# EAGLE schematic Animated LED Shifter using CD4017 (EAGLE 6.6.0)
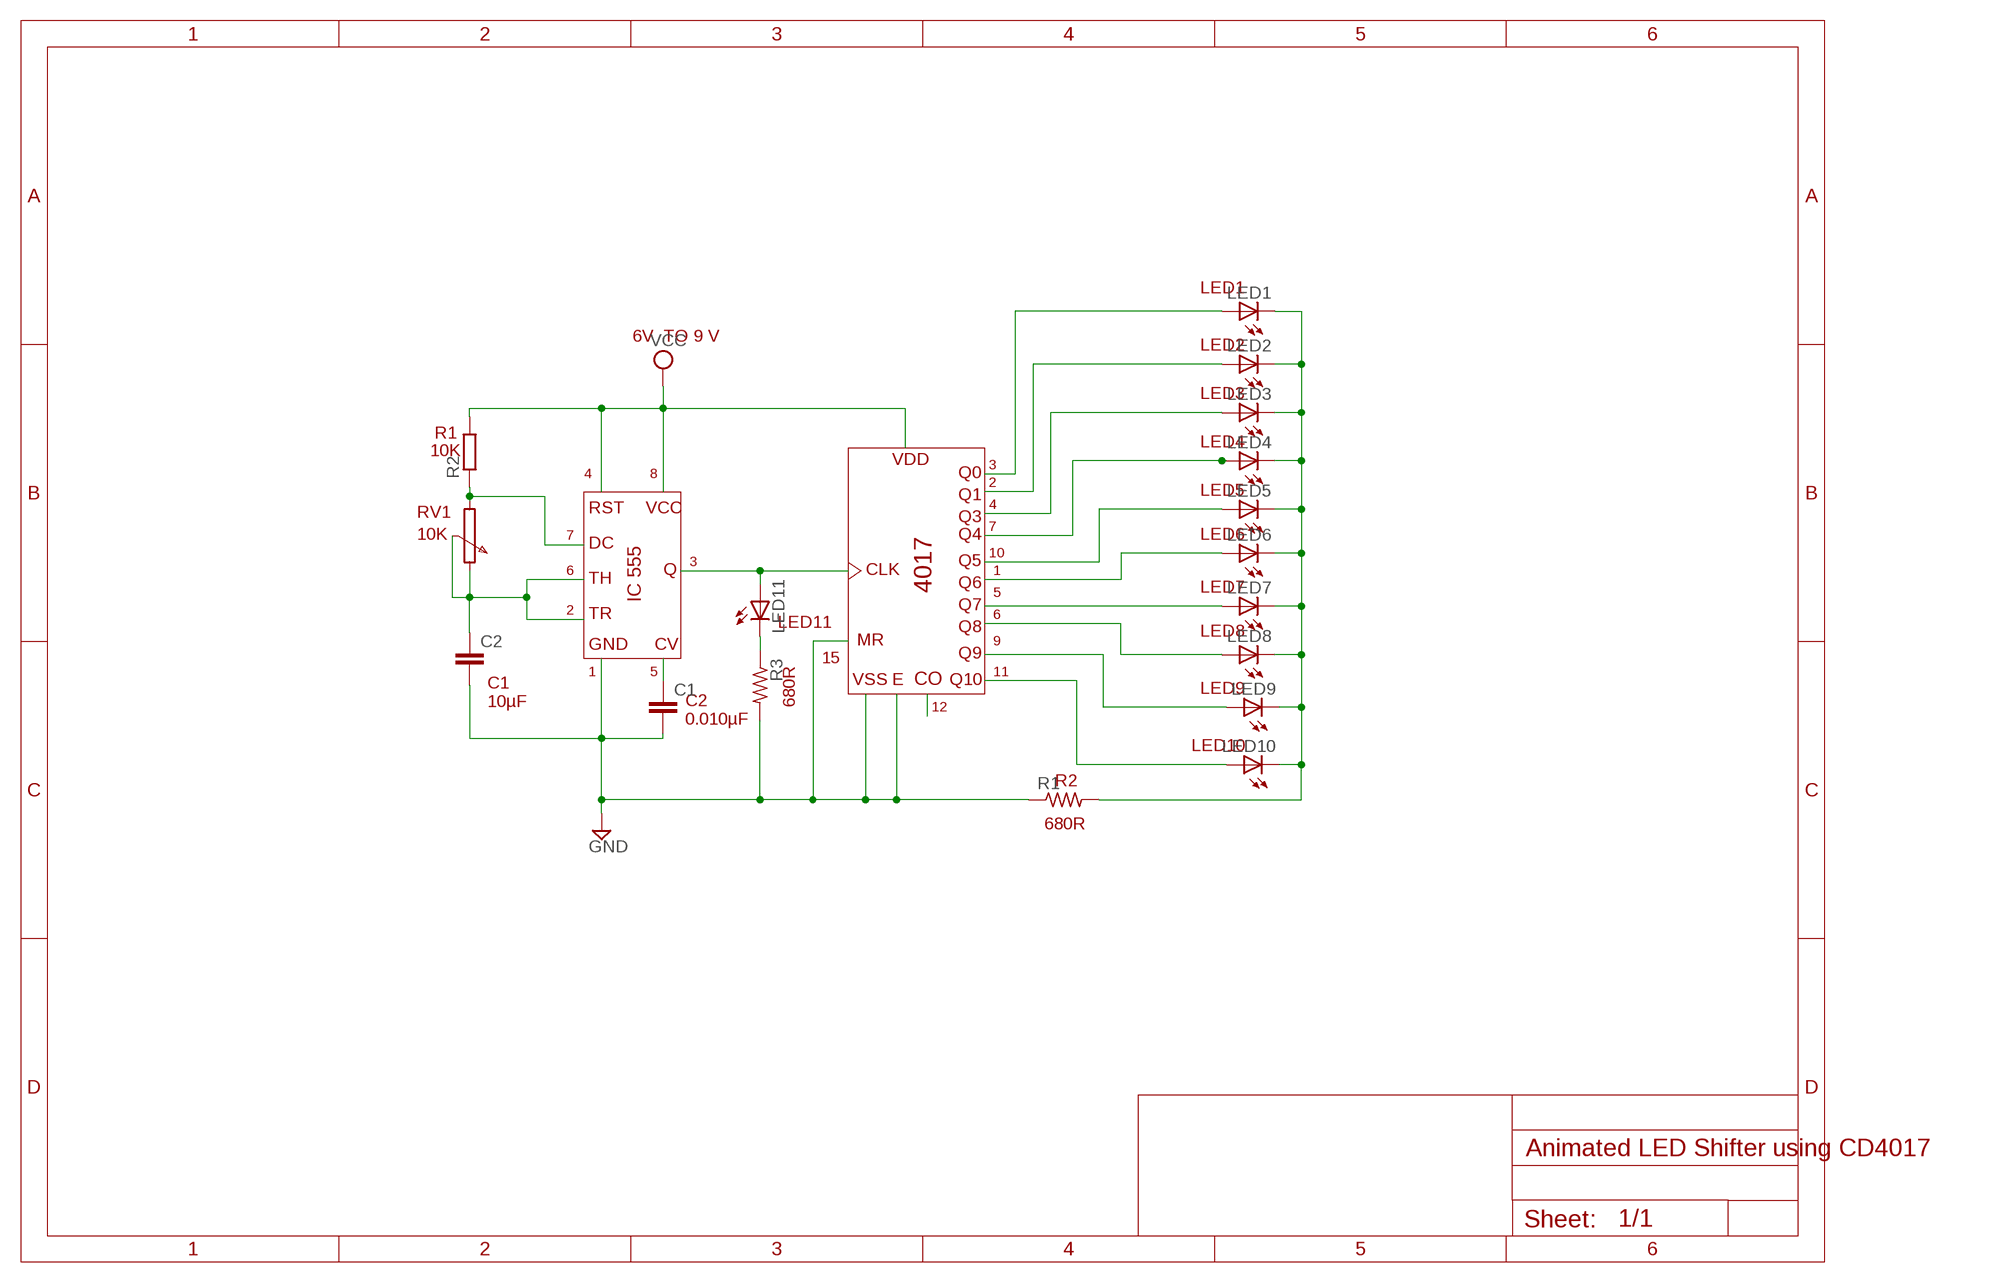
[diagram p0: schematic, sheet 1]

## Parts
C1  C5/3.5  [C5B3.5]
C2  C5/3.5  [C5B3.5]
LED1  LEDMICRO-SIDELED  [MICRO-SIDELED]
LED2  LEDMICRO-SIDELED  [MICRO-SIDELED]
LED3  LEDMICRO-SIDELED  [MICRO-SIDELED]
LED4  LEDMICRO-SIDELED  [MICRO-SIDELED]
LED5  LEDMICRO-SIDELED  [MICRO-SIDELED]
LED6  LEDMICRO-SIDELED  [MICRO-SIDELED]
LED7  LEDMICRO-SIDELED  [MICRO-SIDELED]
LED8  LEDMICRO-SIDELED  [MICRO-SIDELED]
LED9  LEDMICRO-SIDELED  [MICRO-SIDELED]
LED10  LEDMICRO-SIDELED  [MICRO-SIDELED]
LED11  LEDMICRO-SIDELED  [MICRO-SIDELED]
R1  R-US_0207/10  [0207/10]
R2  R-EU_0207/12  [0207/12]
R3  R-US_0207/10  [0207/10]

## Nets
GND: C1.2 C2.2 R1.1 R3.2
N$1: LED1.A
N$2: LED2.A
N$3: LED3.A
N$4: LED4.A
N$5: LED5.A
N$6: LED6.A
N$7: LED7.A
N$8: LED8.A
N$9: LED9.A
N$10: LED10.A
N$11: LED1.C LED2.C LED3.C LED4.C LED5.C LED6.C LED7.C LED8.C LED9.C LED10.C R1.2
N$12: LED11.A
N$13: C1.1
N$14: C2.1
N$15: R2.1
N$17: LED11.C R3.1
VCC: R2.2

## Notes on the sheet
- LED1
- 6V  TO 9 V
- LED2
- LED3
- R1
- LED4
- 10K
- VDD
- 3
- 4 | 8 | Q0
- 2
- Q1 | LED5
- 4
- RV1 | RST | VCC
- Q3
- 7
- 10K | 7 | Q4 | LED6
- DC
- 10
- 3 | Q5
- 6 | Q | CLK | 1
- TH | Q6
- 4017 | LED7
- 5
- IC 555
- Q7
- 2
- TR | 6
- LED11 | Q8
- LED8
- GND | CV | MR | 9
- 15 | Q9
- 1 | 5 | 11
- VSS | E | CO | Q10
- LED9
- C1
  10µF
- 680R
- 12
- C2
  0.010µF
- LED10
- R2
- 680R

## Library data of the parts
C1 C2 = capacitor-wima:C: CAPACITOR naming: grid - package width
LED1-LED11 = led:LED: LED OSRAM: - CHIPLED LG R971, LG N971, LY N971, LG Q971, LY Q971, LO R971, LY R971 LH N974, LH R974 LS Q976, LO Q976, LY Q976 LO Q996 - Hyper CHIPLED LW Q18S LB Q993, LB Q99A, LB R99A - SideLED LS A670, LO A670, LY A670, LG A670, LP A670 LB A673, LV A673, LT A673, LW A673 LH A674 LY A675 LS A676, LA A676, LO A676, LY A676, LW A676 LS A679, LY A679, LG A679 - Hyper Micro SIDELED® LS Y876, LA Y876, LO Y876, LY Y876 LT Y87S - SmartLED LW L88C, LW L88S LB L89C, LB L89S, LG L890 LS L89K, LO L89K, LY L89K LS L896, LA L896, LO L896, LY L896 - TOPLED LS T670, LO T670, LY T670, LG T670, LP T670 LSG T670, LSP T670, LSY T670, LOP T670, LYG T670 LG T671, LOG T671, LSG T671 LB T673, LV T673, LT T673, LW T673 LH T674 LS T676, LA T676, LO T676, LY T676, LB T676, LH T676, LSB T676, LW T676 LB T67C, LV T67C, LT T67C, LS T67K, LO T67K, LY T67K, LW E67C LS E67B, LA E67B, LO E67B, LY E67B, LB E67C, LV E67C, LT E67C LW T67C LS T679, LY T679, LG T679 LS T770, LO T770, LY T770, LG T770, LP T770 LB T773, LV T773, LT T773, LW T773 LH T774 LS E675, LA E675, LY E675, LS T675 LS T776, LA T776, LO T776, LY T776, LB T776 LHGB T686 LT T68C, LB T68C - Hyper Mini TOPLED® LB M676 - Mini TOPLED Santana® LG M470 LS M47K, LO M47K, LY M47K Source: http://www.osram.convergy.de LUXEON: - LUMILED® LXK2-PW12-R00, LXK2-PW12-S00, LXK2-PW14-U00, LXK2-PW14-V00 LXK2-PM12-R00, LXK2-PM12-S00, LXK2-PM14-U00 LXK2-PE12-Q00, LXK2-PE12-R00, LXK2-PE12-S00, LXK2-PE14-T00, LXK2-PE14-U00 LXK2-PB12-K00, LXK2-PB12-L00, LXK2-PB12-M00, LXK2-PB14-N00, LXK2-PB14-P00, LXK2-PB14-Q00 LXK2-PR12-L00, LXK2-PR12-M00, LXK2-PR14-Q00, LXK2-PR14-R00 LXK2-PD12-Q00, LXK2-PD12-R00, LXK2-PD12-S00 LXK2-PH12-R00, LXK2-PH12-S00 LXK2-PL12-P00, LXK2-PL12-Q00, LXK2-PL12-R00 Source: www.luxeon.com KINGBRIGHT: KA-3528ASYC Source: www.kingbright.com
R1 R3 = rcl:R-US_: RESISTOR, American symbol
R2 = rcl:R-EU_: RESISTOR, European symbol